# Altium schematic sheet SNR8503M_BLDC_HALL_6-80V_20A_V2.0.SchDoc
size A3
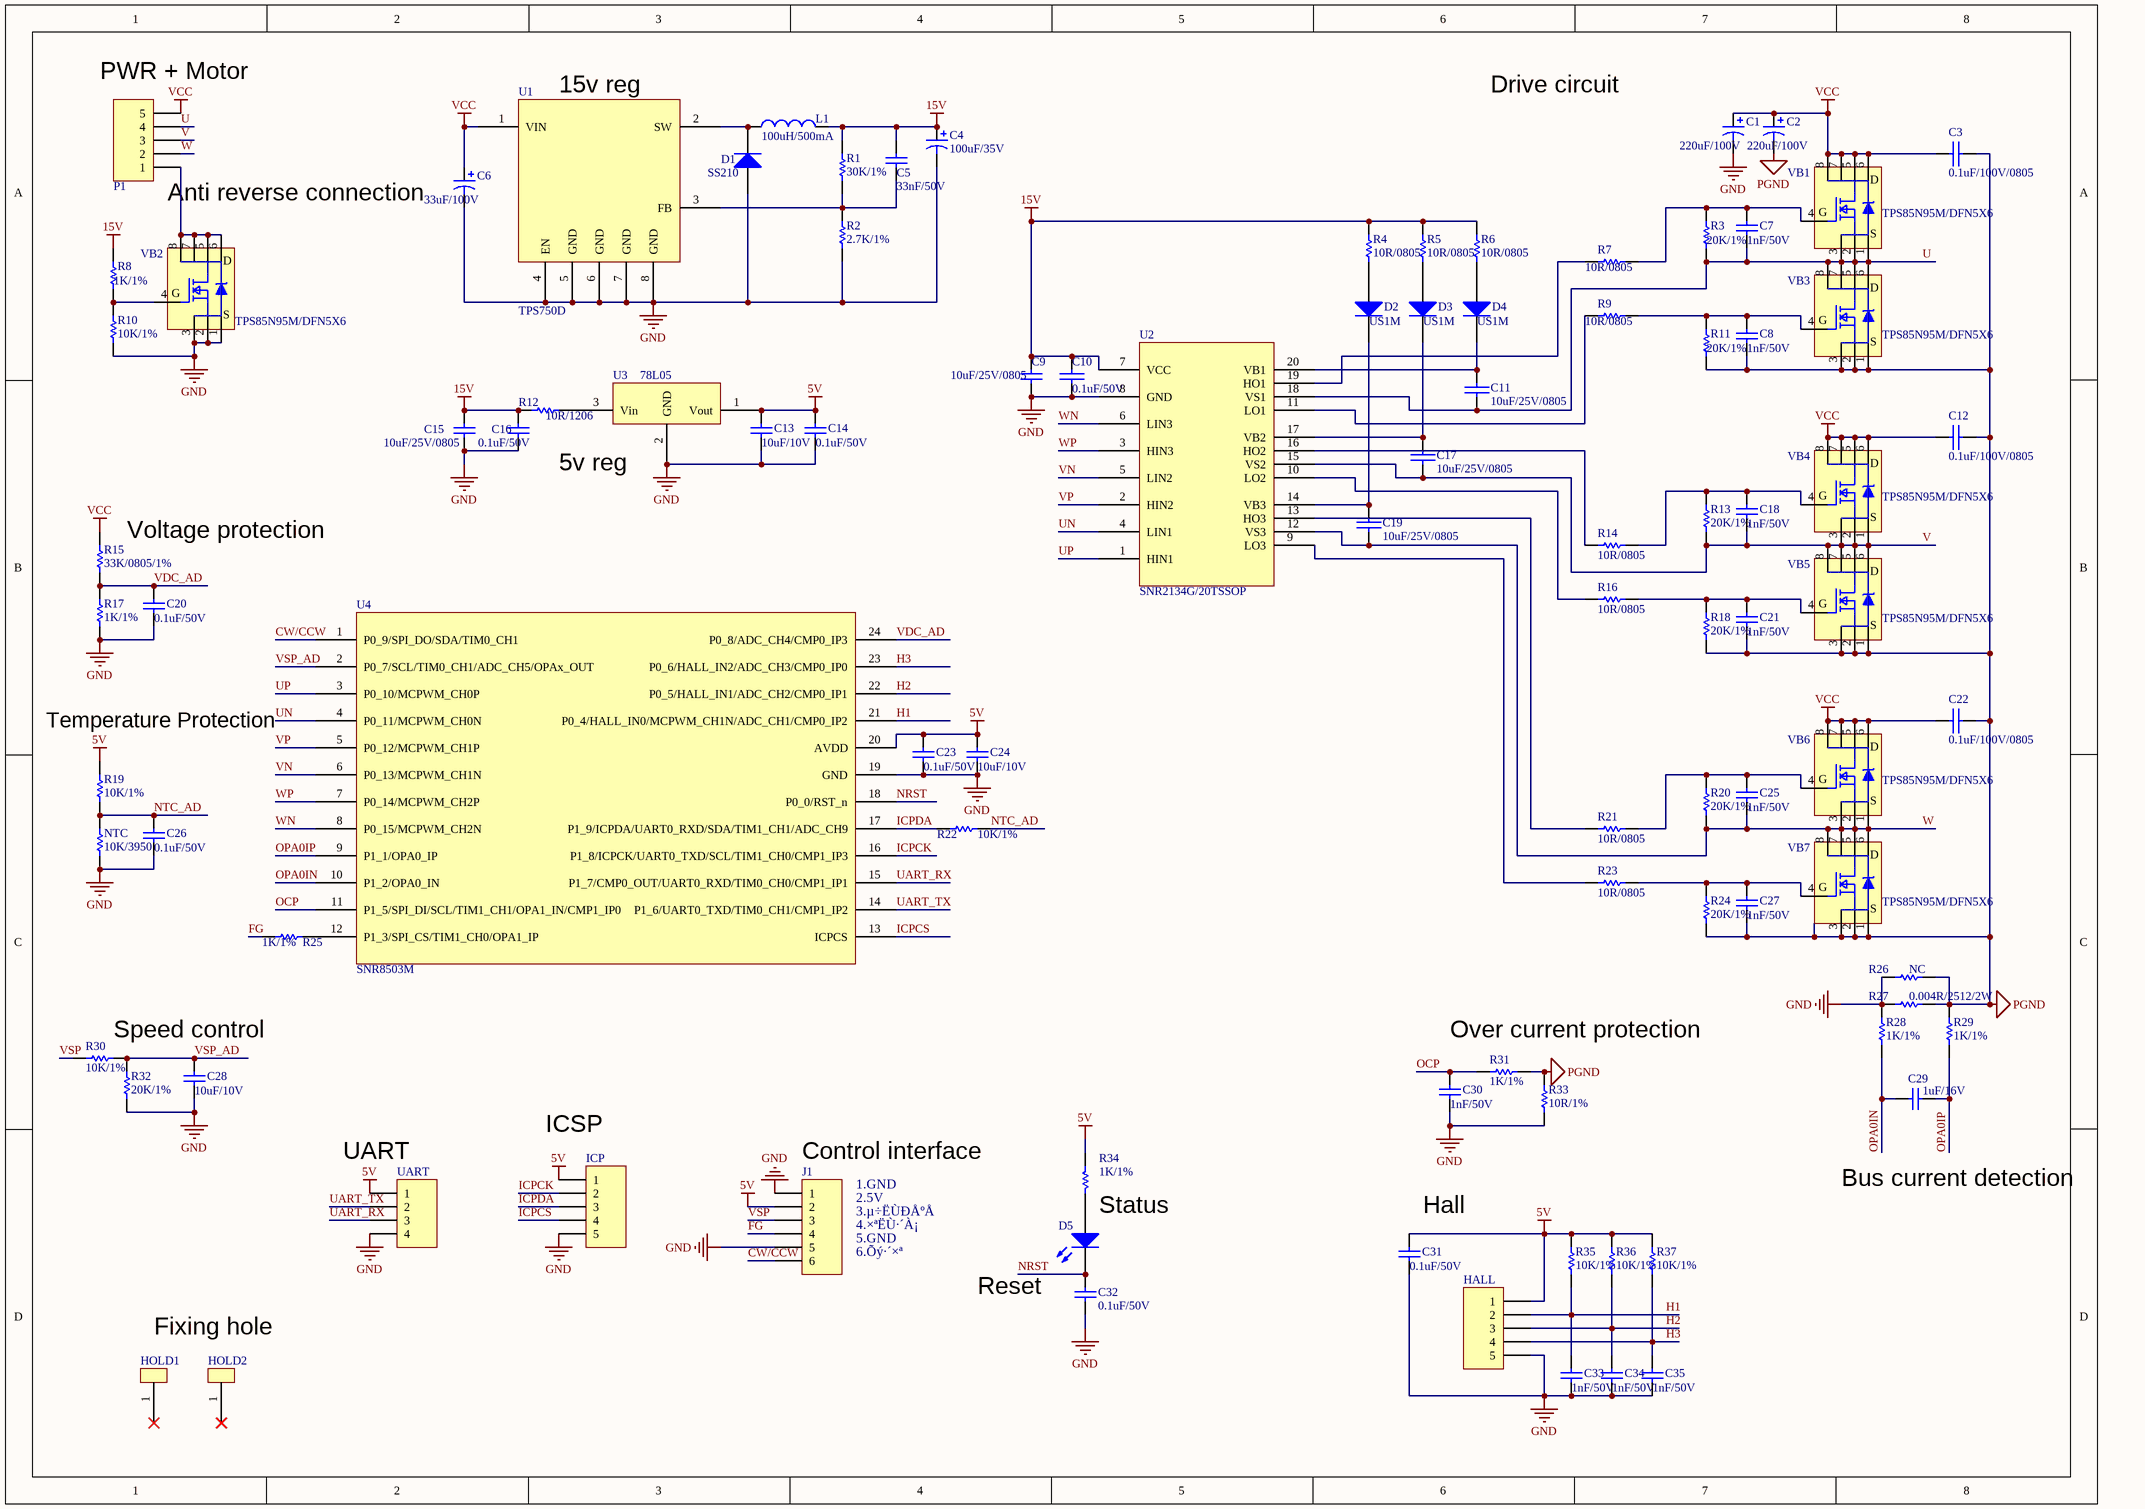
[diagram p0: SNR8503M_BLDC_HALL_6-80V_20A_V2.0.SchDoc]

## Parts
C1  220uF/100V  [CAP 5.0*12.5*20]
C2  220uF/100V  [CAP 5.0*12.5*20]
C3  0.1uF/100V/0805  [C 0805_L]
C4  100uF/35V  [CM D(6.3*7.7)]
C5  33nF/50V  [C 0603_L]
C6  33uF/100V  [CM F(10*10.2)]
C7  1nF/50V  [C 0603_L]
C8  1nF/50V  [C 0603_L]
C9  10uF/25V/0805  [C 0805_L]
C10  0.1uF/50V  [C 0603_L]
C11  10uF/25V/0805  [C 0805_L]
C12  0.1uF/100V/0805  [C 0805_L]
C13  10uF/10V  [C 0603_L]
C14  0.1uF/50V  [C 0603_L]
C15  10uF/25V/0805  [C 0805_L]
C16  0.1uF/50V  [C 0603_L]
C17  10uF/25V/0805  [C 0805_L]
C18  1nF/50V  [C 0603_L]
C19  10uF/25V/0805  [C 0805_L]
C20  0.1uF/50V  [C 0603_L]
C21  1nF/50V  [C 0603_L]
C22  0.1uF/100V/0805  [C 0805_L]
C23  0.1uF/50V  [C 0603_L]
C24  10uF/10V  [C 0603_L]
C25  1nF/50V  [C 0603_L]
C26  0.1uF/50V  [C 0603_L]
C27  1nF/50V  [C 0603_L]
C28  10uF/10V  [C 0603_L]
C29  1uF/16V  [C 0603_L]
C30  1nF/50V  [C 0603_L]
C31  0.1uF/50V  [C 0603_L]
C32  0.1uF/50V  [C 0603_L]
C33  1nF/50V  [C 0603_L]
C34  1nF/50V  [C 0603_L]
C35  1nF/50V  [C 0603_L]
D1  SS210  [SMA]
D2  US1M  [SOD-123]
D3  US1M  [SOD-123]
D4  US1M  [SOD-123]
D5  LED0  [LED 0805R]  (value not drawn)
HALL  Header 5  [HDR2.54-LI-5P]  (value not drawn)
HOLD1  TEST POINT  [HOLD330-600]  (value not drawn)
HOLD2  TEST POINT  [HOLD330-600]  (value not drawn)
ICP  ICP  [HDR2.54-LI-5P]  (value not drawn)
J1  J1  [HDR2.54-LI-6P]  (value not drawn)
L1  100uH/500mA  [NR5020]
NTC  10K/3950  [R 0603_L]
P1  P1  [CONN-TH-5.08-5P]  (value not drawn)
R1  30K/1%  [R 0603_L]
R2  2.7K/1%  [R 0603_L]
R3  20K/1%  [R 0603_L]
R4  10R/0805  [R 0805_L]
R5  10R/0805  [R 0805_L]
R6  10R/0805  [R 0805_L]
R7  10R/0805  [R 0805_L]
R8  1K/1%  [R 0603_L]
R9  10R/0805  [R 0805_L]
R10  10K/1%  [R 0603_L]
R11  20K/1%  [R 0603_L]
R12  10R/1206  [R 1206_L]
R13  20K/1%  [R 0603_L]
R14  10R/0805  [R 0805_L]
R15  33K/0805/1%  [R 0805_L]
R16  10R/0805  [R 0805_L]
R17  1K/1%  [R 0603_L]
R18  20K/1%  [R 0603_L]
R19  10K/1%  [R 0603_L]
R20  20K/1%  [R 0603_L]
R21  10R/0805  [R 0805_L]
R22  10K/1%  [R 0603_L]
R23  10R/0805  [R 0805_L]
R24  20K/1%  [R 0603_L]
R25  1K/1%  [R 0603_L]
R26  NC  [R 2512_L]
R27  0.004R/2512/2W  [R 2512_L]
R28  1K/1%  [R 0603_L]
R29  1K/1%  [R 0603_L]
R30  10K/1%  [R 0603_L]
R31  1K/1%  [R 0603_L]
R32  20K/1%  [R 0603_L]
R33  10R/1%  [R 0603_L]
R34  1K/1%  [R 0603_L]
R35  10K/1%  [R 0603_L]
R36  10K/1%  [R 0603_L]
R37  10K/1%  [R 0603_L]
U1  TPS750D  [SOIC-8_EP]
U2  SNR2134G/20TSSOP  [TSSOP20_L]
U3  78L05  [SOT89_L]
U4  SNR8503M  [SSOP-24_150mil]
UART  UART  [HDR2.54-LI-4P]  (value not drawn)
VB1  TPS85N95M/DFN5X6  [DFN5x6-8L_TPS]
VB2  TPS85N95M/DFN5X6  [DFN5x6-8L_TPS]
VB3  TPS85N95M/DFN5X6  [DFN5x6-8L_TPS]
VB4  TPS85N95M/DFN5X6  [DFN5x6-8L_TPS]
VB5  TPS85N95M/DFN5X6  [DFN5x6-8L_TPS]
VB6  TPS85N95M/DFN5X6  [DFN5x6-8L_TPS]
VB7  TPS85N95M/DFN5X6  [DFN5x6-8L_TPS]

## Nets
5V: C13.2 C14.2 C23.2 C24.2 C31.2 HALL.1 ICP.1 J1.2 R19.2 R34.2 R35.2 R36.2 R37.2 U3.1(Vout) U4.20(AVDD) UART.1
15V: C4.1 C5.2 C9.2 C10.2 C15.2 C16.2 L1.2 R1.1 R4.1 R5.1 R6.1 R8.2 R12.2 U2.7(VCC)
GND: C1.2 C4.2 C6.2 C9.1 C10.1 C13.1 C14.1 C15.1 C16.1 C20.1 C23.1 C24.1 C26.1 C28.1 C30.1 C31.1 C32.1 C33.1 C34.1 C35.1 D1.1(A) HALL.5 ICP.5 J1.1 J1.5 NTC.1 R2.2 R10.1 R17.1 R26.1 R27.1 R28.1 R32.2 R33.2 U1.4(EN) U1.5(GND) U1.6(GND) U1.7(GND) U1.8(GND) U2.8(GND) U3.2(GND) U4.19(GND) UART.4 VB2.1(S) VB2.2(S) VB2.3(S)
PGND: C2.2 C3.1 C8.1 C12.1 C21.1 C22.1 C27.1 R11.2 R18.2 R24.2 R26.2 R27.2 R29.1 R31.2 R33.1 VB3.1(S) VB3.2(S) VB3.3(S) VB5.1(S) VB5.2(S) VB5.3(S) VB7.1(S) VB7.2(S) VB7.3(S)
VCC: C1.1 C2.1 C3.2 C6.1 C12.2 C22.2 P1.5 R15.2 U1.1(VIN) VB1.5(D) VB1.6(D) VB1.7(D) VB1.8(D) VB4.5(D) VB4.6(D) VB4.7(D) VB4.8(D) VB6.5(D) VB6.6(D) VB6.7(D) VB6.8(D)
CW/CCW: J1.6 U4.1(P0_9/SPI_DO/SDA/TIM0_CH1)
FG: J1.4 R25.2
H1: C33.2 HALL.2 R35.1 U4.21(P0_4/HALL_IN0/MCPWM_CH1N/ADC_CH1/CMP0_IP2)
H2: C34.2 HALL.3 R36.1 U4.22(P0_5/HALL_IN1/ADC_CH2/CMP0_IP1)
H3: C35.2 HALL.4 R37.1 U4.23(P0_6/HALL_IN2/ADC_CH3/CMP0_IP0)
ICPCK: ICP.2 U4.16(P1_8/ICPCK/UART0_TXD/SCL/TIM1_CH0/CMP1_IP3)
ICPCS: ICP.4 U4.13(ICPCS)
ICPDA: ICP.3 R22.2 U4.17(P1_9/ICPDA/UART0_RXD/SDA/TIM1_CH1/ADC_CH9)
NRST: C32.2 D5.2(K) U4.18(P0_0/RST_n)
NTC_AD: C26.2 NTC.2 R19.1 R22.1
OCP: C30.2 R31.1 U4.11(P1_5/SPI_DI/SCL/TIM1_CH1/OPA1_IN/CMP1_IP0)
OPA0IN: C29.2 R28.2 U4.10(P1_2/OPA0_IN)
OPA0IP: C29.1 R29.2 U4.9(P1_1/OPA0_IP)
U: C7.1 C11.2 P1.4 R3.2 U2.18(VS1) VB1.1(S) VB1.2(S) VB1.3(S) VB3.5(D) VB3.6(D) VB3.7(D) VB3.8(D)
UART_RX: U4.15(P1_7/CMP0_OUT/UART0_RXD/TIM0_CH0/CMP1_IP1) UART.3
UART_TX: U4.14(P1_6/UART0_TXD/TIM0_CH1/CMP1_IP2) UART.2
UN: U2.4(LIN1) U4.4(P0_11/MCPWM_CH0N)
UP: U2.1(HIN1) U4.3(P0_10/MCPWM_CH0P)
V: C17.2 C18.1 P1.3 R13.2 U2.15(VS2) VB4.1(S) VB4.2(S) VB4.3(S) VB5.5(D) VB5.6(D) VB5.7(D) VB5.8(D)
VDC_AD: C20.2 R15.1 R17.2 U4.24(P0_8/ADC_CH4/CMP0_IP3)
VN: U2.5(LIN2) U4.6(P0_13/MCPWM_CH1N)
VP: U2.2(HIN2) U4.5(P0_12/MCPWM_CH1P)
VSP: J1.3 R30.2
VSP_AD: C28.2 R30.1 R32.1 U4.2(P0_7/SCL/TIM0_CH1/ADC_CH5/OPAx_OUT)
W: C19.2 C25.1 P1.2 R20.2 U2.12(VS3) VB6.1(S) VB6.2(S) VB6.3(S) VB7.5(D) VB7.6(D) VB7.7(D) VB7.8(D)
WN: U2.6(LIN3) U4.8(P0_15/MCPWM_CH2N)
WP: U2.3(HIN3) U4.7(P0_14/MCPWM_CH2P)
NetC5_1: C5.1 R1.2 R2.1 U1.3(FB)
NetC7_2: C7.2 R3.1 R7.1 VB1.4(G)
NetC8_2: C8.2 R9.1 R11.1 VB3.4(G)
NetC11_1: C11.1 D4.2(K) U2.20(VB1)
NetC17_1: C17.1 D3.2(K) U2.17(VB2)
NetC18_2: C18.2 R13.1 R14.1 VB4.4(G)
NetC19_1: C19.1 D2.2(K) U2.14(VB3)
NetC21_2: C21.2 R16.1 R18.1 VB5.4(G)
NetC25_2: C25.2 R20.1 R21.1 VB6.4(G)
NetC27_2: C27.2 R23.1 R24.1 VB7.4(G)
NetD1_2: D1.2(K) L1.1 U1.2(SW)
NetD2_1: D2.1(A) R4.2
NetD3_1: D3.1(A) R5.2
NetD4_1: D4.1(A) R6.2
NetD5_1: D5.1(A) R34.1
NetP1_1: P1.1 VB2.5(D) VB2.6(D) VB2.7(D) VB2.8(D)
NetR7_2: R7.2 U2.19(HO1)
NetR8_1: R8.1 R10.2 VB2.4(G)
NetR9_2: R9.2 U2.11(LO1)
NetR12_1: R12.1 U3.3(Vin)
NetR14_2: R14.2 U2.16(HO2)
NetR16_2: R16.2 U2.10(LO2)
NetR21_2: R21.2 U2.13(HO3)
NetR23_2: R23.2 U2.9(LO3)
NetR25_1: R25.1 U4.12(P1_3/SPI_CS/TIM1_CH0/OPA1_IP)

Not connected (* = marked no-connect by the designer): HOLD1 1(VOUT)*; HOLD2 1(VOUT)*

## Notes on the sheet
- 1.GND
- 2.5V
- 3.µ÷ËÙÐÅºÅ
- 6.Õý·´×ª
- 4.×ªËÙ·´À¡
- 5.GND
- Labels drawn without touching a wire or pin: 5v reg, 15v reg, Anti reverse connection, Bus current detection, Control interface, Drive circuit, Fixing hole, Hall, ICSP, Over current protection, PWR + Motor, Reset, Speed control, Status, Temperature Protection, UART, Voltage protection

## Library data of the parts
C1 C2 C4 C6 = Cap Pol1: Polarized Capacitor (Radial); Value: 100pF; Published: 8-Jun-2000; LatestRevisionDate: 17-Jul-2002; LatestRevisionNote: Re-released for DXP Platform.; PackageReference: RB7.6-15; Publisher: Altium Limited; PackageDescription: Polarized Capacitor (Radial); 2 Leads
C3 C10-C12 C17 C19 C22 = C: Capacitor
C5 C7-C9 C13-C16 C18 C20 C21 C23-C35 = Cap: Capacitor; Value: 100pF; Published: 8-Jun-2000; LatestRevisionDate: 17-Jul-2002; LatestRevisionNote: Re-released for DXP Platform.; PackageReference: RAD-0.3; Publisher: Altium Limited; PackageDescription: Radial Cap, Thru-Hole; 2 Leads; 0.3 in Pin Spacing
D1-D4 = Diode: Default Diode; Published: 8-Jun-2000; LatestRevisionDate: 17-Jul-2002; LatestRevisionNote: Re-released for DXP Platform.; PackageVersion: Sep-1996; PackageReference: SMC; Publisher: Altium Limited; PackageDescription: DO-214-AB/SMC; 2 C-Bend Leads; Body 7.9 x 5.9 mm, inc. leads (LxW); Code_JEDEC: DO-214-AB
D5 = LED0: Typical INFRARED GaAs LED; Published: 8-Jun-2000; LatestRevisionDate: 08-Jul-2005; LatestRevisionNote: Mech Layer 1 removed.; PackageReference: LED-0; Publisher: Altium Limited; PackageDescription: LED; 2 Leads
HALL ICP P1 = Header 5: Header, 5-Pin; LatestRevisionDate: 17-Jul-2002; LatestRevisionNote: Re-released for DXP Platform.; Publisher: Altium Limited
J1 = Header 6: Header, 6-Pin; LatestRevisionDate: 17-Jul-2002; LatestRevisionNote: Re-released for DXP Platform.; Publisher: Altium Limited
L1 = Inductor: Code_IEC: 1005; Value: 47uH 500mA; Published: 8-Jun-2000; LatestRevisionDate: 29-May-2009; LatestRevisionNote: IPC-7351 Footprint Added.; PackageReference: 0402-A; Publisher: Altium Limited; PackageDescription: Chip Inductor; Code_JEITA: 0402
NTC R1 R2 R7 R9 R14-R17 R19 R21-R23 R25-R37 = Res1: Resistor; Value: 1K; Published: 8-Jun-2000; LatestRevisionDate: 17-Jul-2002; LatestRevisionNote: Re-released for DXP Platform.; PackageReference: AXIAL-0.3; Publisher: Altium Limited; PackageDescription: Axial Device, Thru-Hole; 2 Leads; 0.3 in Pin Spacing
R3 R11 R13 R18 R20 R24 = Res1: Resistor; Value: 4.7K; Published: 8-Jun-2000; LatestRevisionDate: 17-Jul-2002; LatestRevisionNote: Re-released for DXP Platform.; PackageReference: AXIAL-0.3; Publisher: Altium Limited; PackageDescription: Axial Device, Thru-Hole; 2 Leads; 0.3 in Pin Spacing
R4-R6 = Res1: Resistor; Value: 10R/1206; Published: 8-Jun-2000; LatestRevisionDate: 17-Jul-2002; LatestRevisionNote: Re-released for DXP Platform.; PackageReference: AXIAL-0.3; Publisher: Altium Limited; PackageDescription: Axial Device, Thru-Hole; 2 Leads; 0.3 in Pin Spacing
R8 = Res1: Resistor; Value: 1K/5%; Published: 8-Jun-2000; LatestRevisionDate: 17-Jul-2002; LatestRevisionNote: Re-released for DXP Platform.; PackageReference: AXIAL-0.3; Publisher: Altium Limited; PackageDescription: Axial Device, Thru-Hole; 2 Leads; 0.3 in Pin Spacing
R10 = Res1: Resistor; Value: 10K/0603/5%; Published: 8-Jun-2000; LatestRevisionDate: 17-Jul-2002; LatestRevisionNote: Re-released for DXP Platform.; PackageReference: AXIAL-0.3; Publisher: Altium Limited; PackageDescription: Axial Device, Thru-Hole; 2 Leads; 0.3 in Pin Spacing
R12 = Res1: Resistor; Published: 8-Jun-2000; LatestRevisionDate: 17-Jul-2002; LatestRevisionNote: Re-released for DXP Platform.; PackageReference: AXIAL-0.3; Publisher: Altium Limited; PackageDescription: Axial Device, Thru-Hole; 2 Leads; 0.3 in Pin Spacing; Value: 10R/1206
U2 = SNR2134G
U4 = SNR8503M_1
UART = Header 4: Header, 4-Pin; LatestRevisionDate: 17-Jul-2002; LatestRevisionNote: Re-released for DXP Platform.; Publisher: Altium Limited
VB1-VB7 = MOSFET8-A: MOS